# EAGLE design untitled (EAGLE 9.1.3)

## Sheet 1 of 2
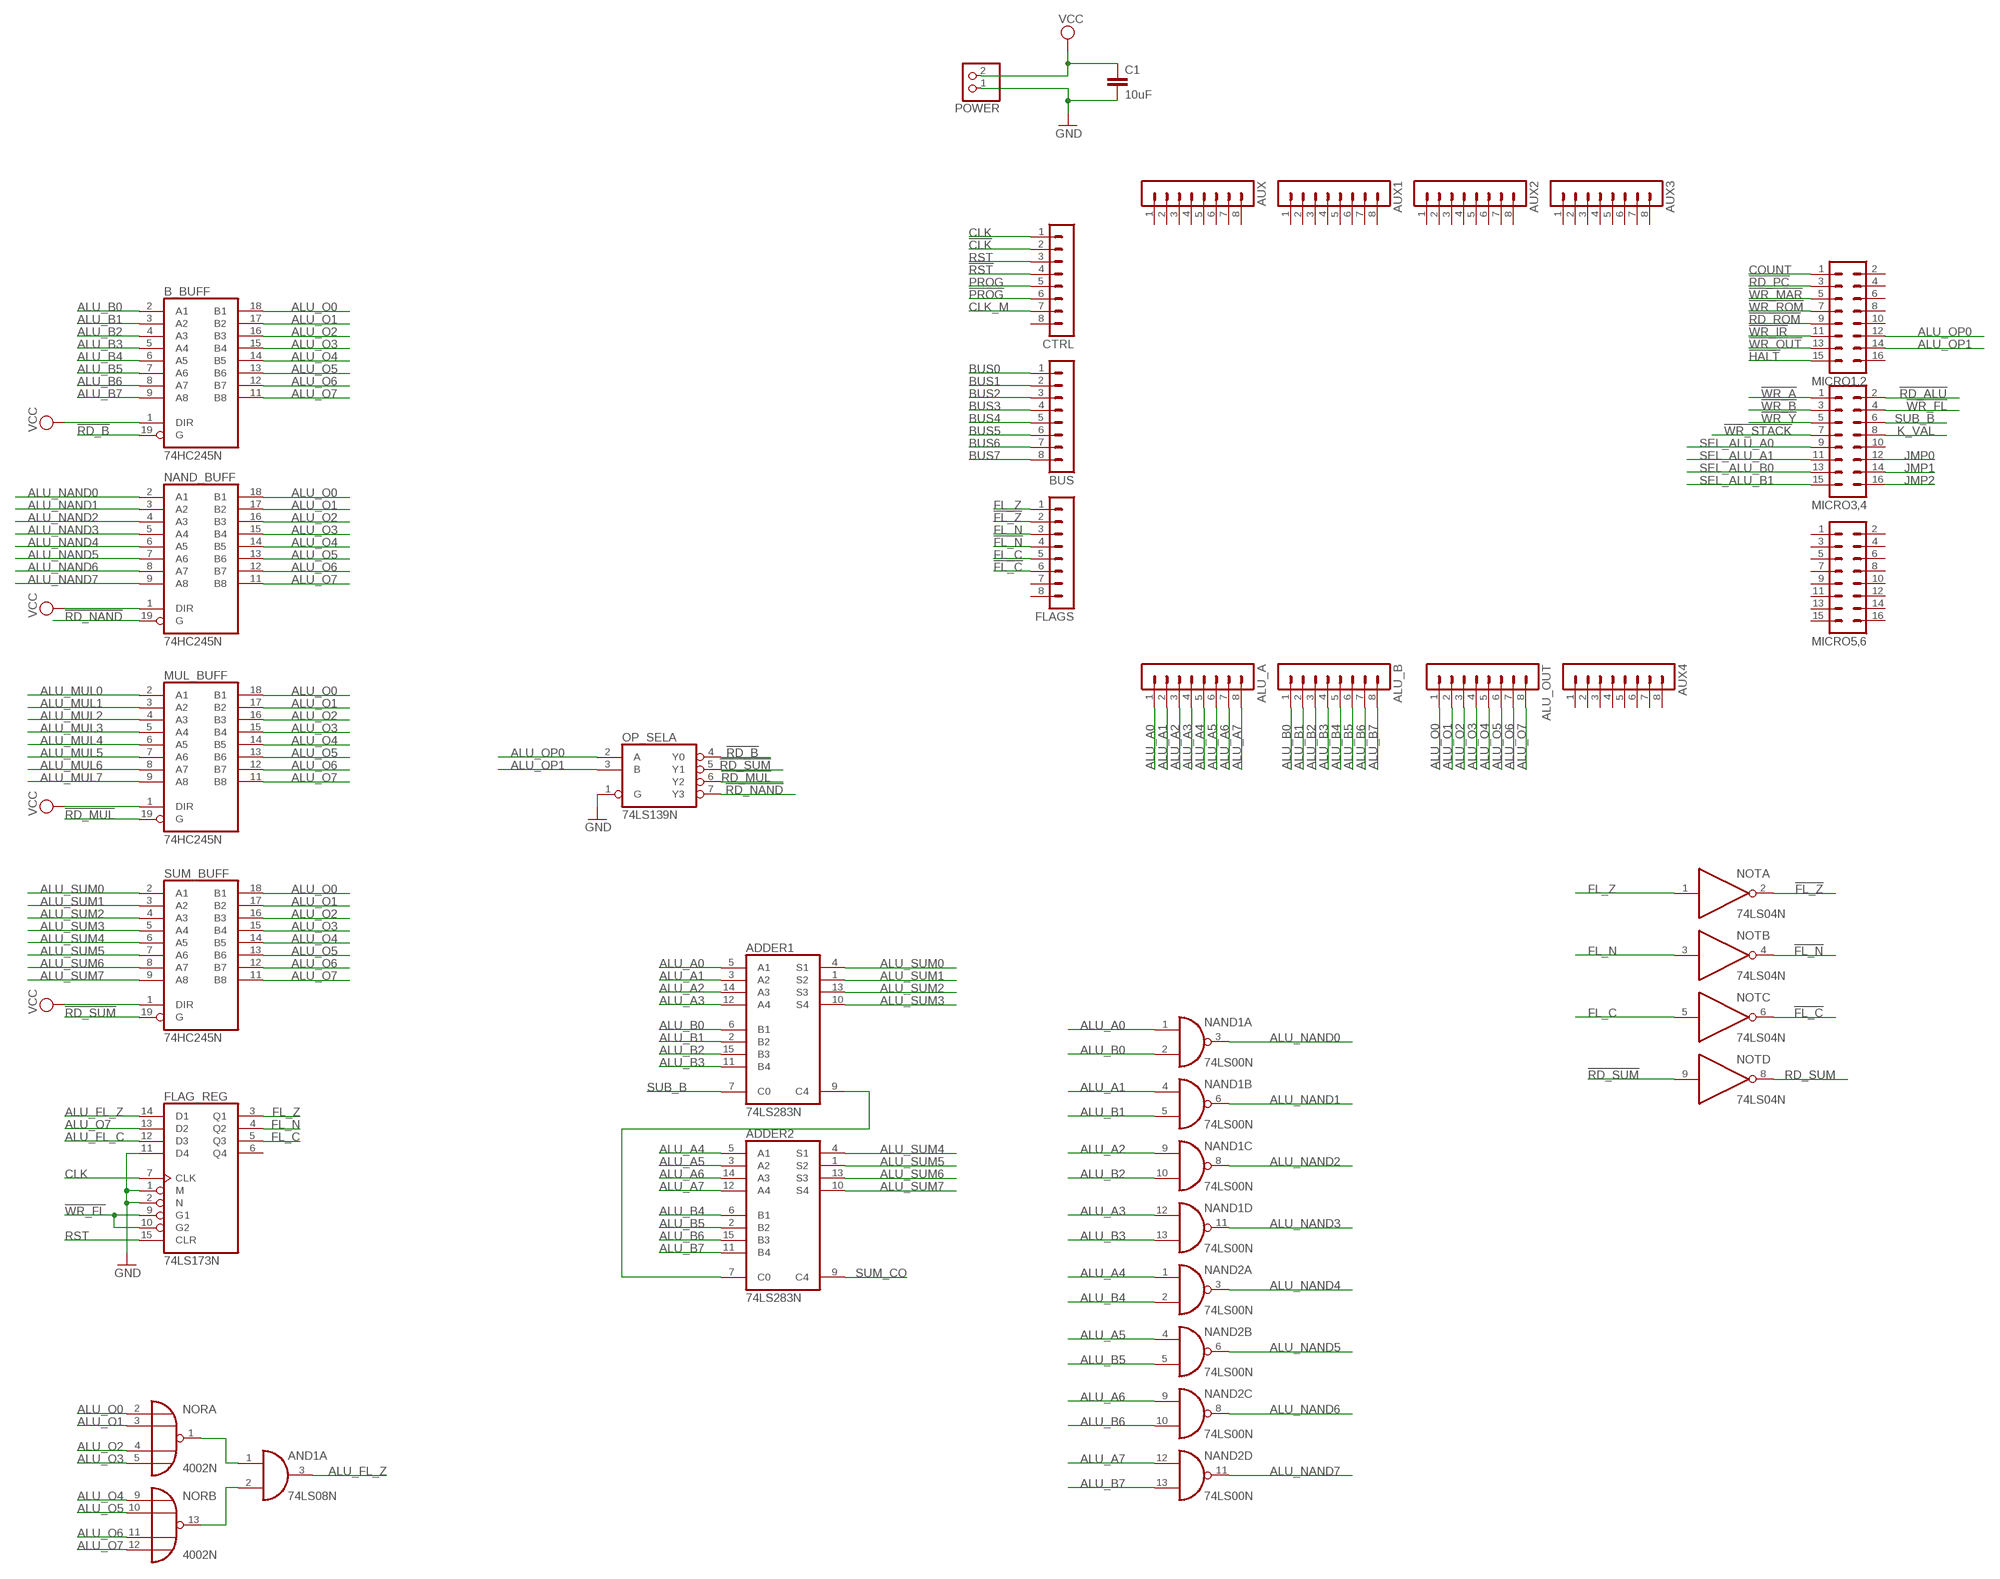
[diagram p0: schematic, sheet 1, part 1 of 2]
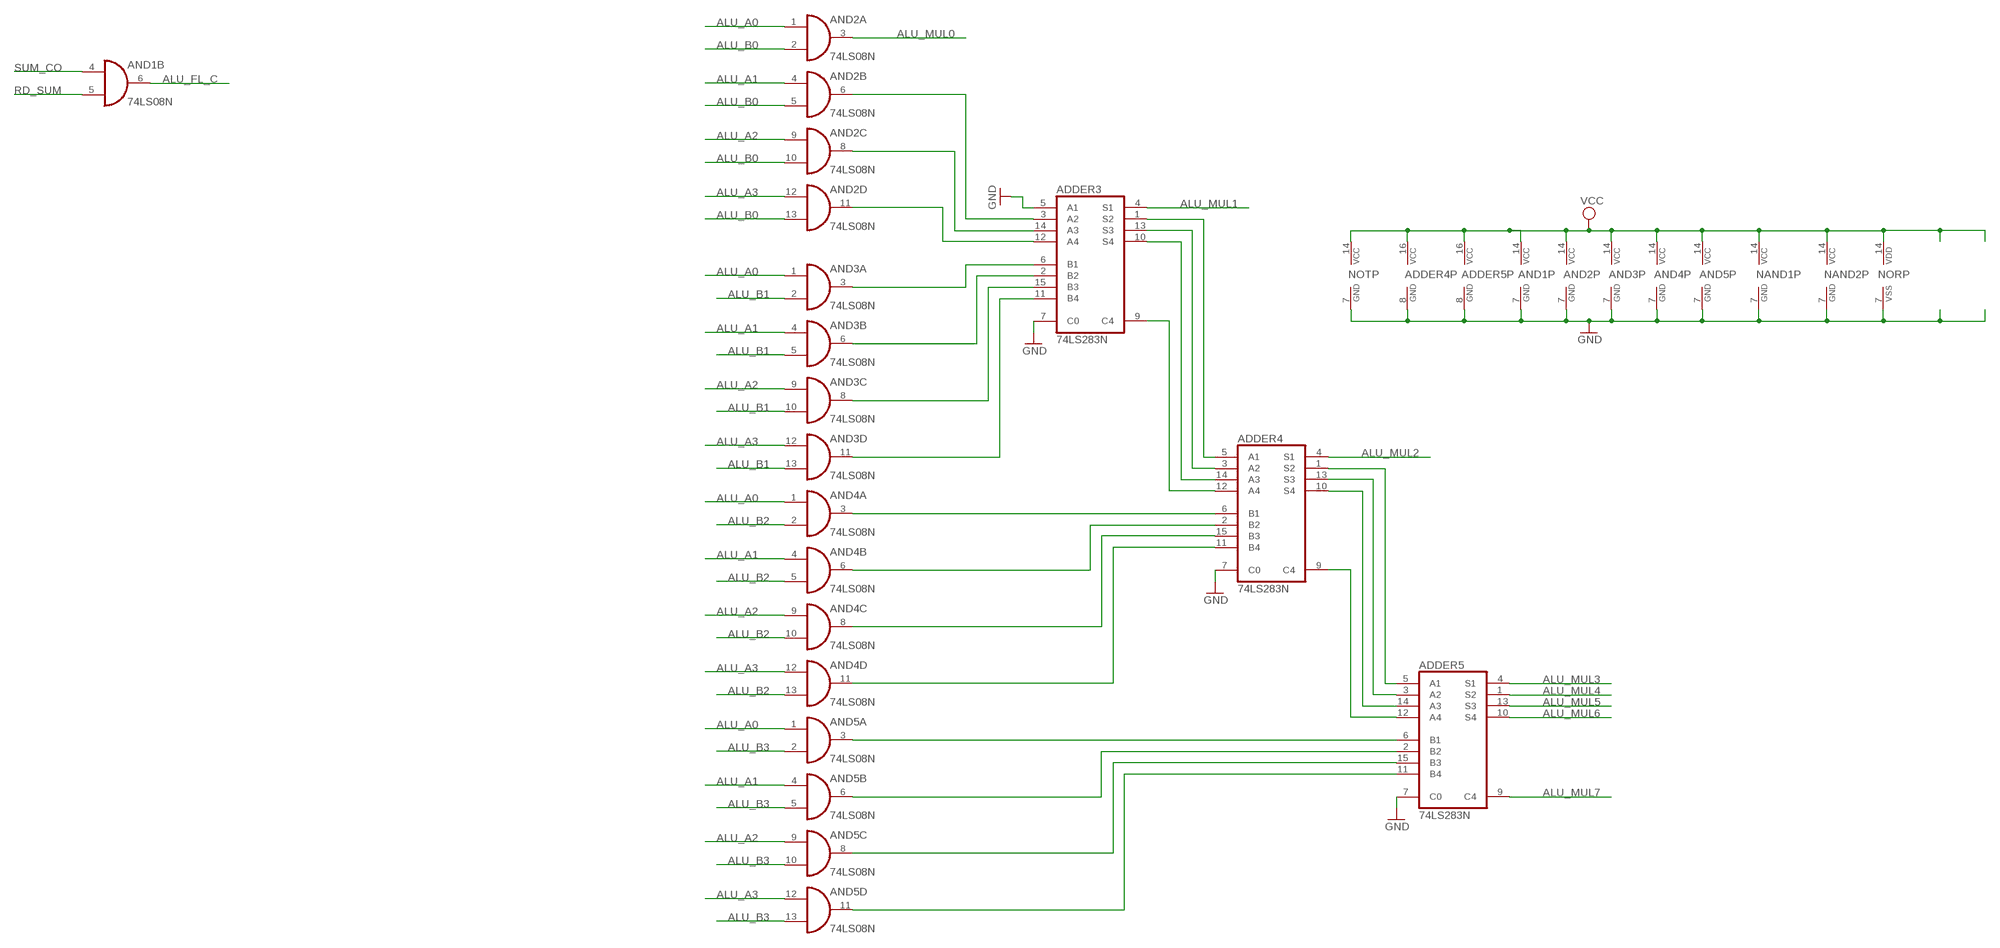
[diagram p1: schematic, sheet 1, part 2 of 2]

### Parts
ADDER1  74LS283N  [DIL16]
ADDER2  74LS283N  [DIL16]
ADDER3  74LS283N  [DIL16]
ADDER4  74LS283N  [DIL16]
ADDER5  74LS283N  [DIL16]
ALU_A  MA08-1  [MA08-1]
ALU_B  MA08-1  [MA08-1]
ALU_OUT  MA08-1  [MA08-1]
AND1  74LS08N  [DIL14]
AND2  74LS08N  [DIL14]
AND3  74LS08N  [DIL14]
AND4  74LS08N  [DIL14]
AND5  74LS08N  [DIL14]
AUX  MA08-1  [MA08-1]
AUX1  MA08-1  [MA08-1]
AUX2  MA08-1  [MA08-1]
AUX3  MA08-1  [MA08-1]
AUX4  MA08-1  [MA08-1]
B_BUFF  74HC245N  [DIL20]
BUS  MA08-1  [MA08-1]
C1  10uF  C-EU025-050X050  [C025-050X050]
CTRL  MA08-1  [MA08-1]
FLAG_REG  74LS173N  [DIL16]
FLAGS  MA08-1  [MA08-1]
MICRO1,2  MA08-2  [MA08-2]
MICRO3,4  MA08-2  [MA08-2]
MICRO5,6  MA08-2  [MA08-2]
MUL_BUFF  74HC245N  [DIL20]
NAND1  74LS00N  [DIL14]
NAND2  74LS00N  [DIL14]
NAND_BUFF  74HC245N  [DIL20]
NOR  4002N  [DIL14]
NOT  74LS04N  [DIL14]
OP_SEL  74LS139N  [DIL16]
POWER  PINHD-1X2  [1X02]
SUM_BUFF  74HC245N  [DIL20]

### Nets
!CLK: CTRL.2
!FL_C: FLAGS.6 NOT.6(C:O)
!FL_N: FLAGS.4 NOT.4(B:O)
!FL_Z: FLAGS.2 NOT.2(A:O)
!HALT: MICRO1,2.15
!PROG: CTRL.6
!RD_ALU: MICRO3,4.2
!RD_B: B_BUFF.19(G) OP_SEL.4(A:Y0)
!RD_MUL: MUL_BUFF.19(G) OP_SEL.6(A:Y2)
!RD_NAND: NAND_BUFF.19(G) OP_SEL.7(A:Y3)
!RD_PC: MICRO1,2.3
!RD_ROM: MICRO1,2.9
!RD_SUM: NOT.9(D:I) OP_SEL.5(A:Y1) SUM_BUFF.19(G)
!RST: CTRL.4
!WR_A: MICRO3,4.1
!WR_B: MICRO3,4.3
!WR_FL: FLAG_REG.9(G1) FLAG_REG.10(G2) MICRO3,4.4
!WR_IR: MICRO1,2.11
!WR_MAR: MICRO1,2.5
!WR_OUT: MICRO1,2.13
!WR_ROM: MICRO1,2.7
!WR_STACK: MICRO3,4.7
!WR_Y: MICRO3,4.5
ALU_A0: ADDER1.5(A1) ALU_A.1 AND2.1(A:I0) AND3.1(A:I0) AND4.1(A:I0) AND5.1(A:I0) NAND1.1(A:I0)
ALU_A1: ADDER1.3(A2) ALU_A.2 AND2.4(B:I0) AND3.4(B:I0) AND4.4(B:I0) AND5.4(B:I0) NAND1.4(B:I0)
ALU_A2: ADDER1.14(A3) ALU_A.3 AND2.9(C:I0) AND3.9(C:I0) AND4.9(C:I0) AND5.9(C:I0) NAND1.9(C:I0)
ALU_A3: ADDER1.12(A4) ALU_A.4 AND2.12(D:I0) AND3.12(D:I0) AND4.12(D:I0) AND5.12(D:I0) NAND1.12(D:I0)
ALU_A4: ADDER2.5(A1) ALU_A.5 NAND2.1(A:I0)
ALU_A5: ADDER2.3(A2) ALU_A.6 NAND2.4(B:I0)
ALU_A6: ADDER2.14(A3) ALU_A.7 NAND2.9(C:I0)
ALU_A7: ADDER2.12(A4) ALU_A.8 NAND2.12(D:I0)
ALU_B0: ADDER1.6(B1) ALU_B.1 AND2.2(A:I1) AND2.5(B:I1) AND2.10(C:I1) AND2.13(D:I1) B_BUFF.2(A1) NAND1.2(A:I1)
ALU_B1: ADDER1.2(B2) ALU_B.2 AND3.2(A:I1) AND3.5(B:I1) AND3.10(C:I1) AND3.13(D:I1) B_BUFF.3(A2) NAND1.5(B:I1)
ALU_B2: ADDER1.15(B3) ALU_B.3 AND4.2(A:I1) AND4.5(B:I1) AND4.10(C:I1) AND4.13(D:I1) B_BUFF.4(A3) NAND1.10(C:I1)
ALU_B3: ADDER1.11(B4) ALU_B.4 AND5.2(A:I1) AND5.5(B:I1) AND5.10(C:I1) AND5.13(D:I1) B_BUFF.5(A4) NAND1.13(D:I1)
ALU_B4: ADDER2.6(B1) ALU_B.5 B_BUFF.6(A5) NAND2.2(A:I1)
ALU_B5: ADDER2.2(B2) ALU_B.6 B_BUFF.7(A6) NAND2.5(B:I1)
ALU_B6: ADDER2.15(B3) ALU_B.7 B_BUFF.8(A7) NAND2.10(C:I1)
ALU_B7: ADDER2.11(B4) ALU_B.8 B_BUFF.9(A8) NAND2.13(D:I1)
ALU_FL_C: AND1.6(B:O) FLAG_REG.12(D3)
ALU_FL_Z: AND1.3(A:O) FLAG_REG.14(D1)
ALU_MUL0: AND2.3(A:O) MUL_BUFF.2(A1)
ALU_MUL1: ADDER3.4(S1) MUL_BUFF.3(A2)
ALU_MUL2: ADDER4.4(S1) MUL_BUFF.4(A3)
ALU_MUL3: ADDER5.4(S1) MUL_BUFF.5(A4)
ALU_MUL4: ADDER5.1(S2) MUL_BUFF.6(A5)
ALU_MUL5: ADDER5.13(S3) MUL_BUFF.7(A6)
ALU_MUL6: ADDER5.10(S4) MUL_BUFF.8(A7)
ALU_MUL7: ADDER5.9(C4) MUL_BUFF.9(A8)
ALU_NAND0: NAND1.3(A:O) NAND_BUFF.2(A1)
ALU_NAND1: NAND1.6(B:O) NAND_BUFF.3(A2)
ALU_NAND2: NAND1.8(C:O) NAND_BUFF.4(A3)
ALU_NAND3: NAND1.11(D:O) NAND_BUFF.5(A4)
ALU_NAND4: NAND2.3(A:O) NAND_BUFF.6(A5)
ALU_NAND5: NAND2.6(B:O) NAND_BUFF.7(A6)
ALU_NAND6: NAND2.8(C:O) NAND_BUFF.8(A7)
ALU_NAND7: NAND2.11(D:O) NAND_BUFF.9(A8)
ALU_O0: ALU_OUT.1 B_BUFF.18(B1) MUL_BUFF.18(B1) NAND_BUFF.18(B1) NOR.2(A:I0) SUM_BUFF.18(B1)
ALU_O1: ALU_OUT.2 B_BUFF.17(B2) MUL_BUFF.17(B2) NAND_BUFF.17(B2) NOR.3(A:I1) SUM_BUFF.17(B2)
ALU_O2: ALU_OUT.3 B_BUFF.16(B3) MUL_BUFF.16(B3) NAND_BUFF.16(B3) NOR.4(A:I2) SUM_BUFF.16(B3)
ALU_O3: ALU_OUT.4 B_BUFF.15(B4) MUL_BUFF.15(B4) NAND_BUFF.15(B4) NOR.5(A:I3) SUM_BUFF.15(B4)
ALU_O4: ALU_OUT.5 B_BUFF.14(B5) MUL_BUFF.14(B5) NAND_BUFF.14(B5) NOR.9(B:I0) SUM_BUFF.14(B5)
ALU_O5: ALU_OUT.6 B_BUFF.13(B6) MUL_BUFF.13(B6) NAND_BUFF.13(B6) NOR.10(B:I1) SUM_BUFF.13(B6)
ALU_O6: ALU_OUT.7 B_BUFF.12(B7) MUL_BUFF.12(B7) NAND_BUFF.12(B7) NOR.11(B:I2) SUM_BUFF.12(B7)
ALU_O7: ALU_OUT.8 B_BUFF.11(B8) FLAG_REG.13(D2) MUL_BUFF.11(B8) NAND_BUFF.11(B8) NOR.12(B:I3) SUM_BUFF.11(B8)
ALU_OP0: MICRO1,2.12 OP_SEL.2(A:A)
ALU_OP1: MICRO1,2.14 OP_SEL.3(A:B)
ALU_SUM0: ADDER1.4(S1) SUM_BUFF.2(A1)
ALU_SUM1: ADDER1.1(S2) SUM_BUFF.3(A2)
ALU_SUM2: ADDER1.13(S3) SUM_BUFF.4(A3)
ALU_SUM3: ADDER1.10(S4) SUM_BUFF.5(A4)
ALU_SUM4: ADDER2.4(S1) SUM_BUFF.6(A5)
ALU_SUM5: ADDER2.1(S2) SUM_BUFF.7(A6)
ALU_SUM6: ADDER2.13(S3) SUM_BUFF.8(A7)
ALU_SUM7: ADDER2.10(S4) SUM_BUFF.9(A8)
BUS0: BUS.1
BUS1: BUS.2
BUS2: BUS.3
BUS3: BUS.4
BUS4: BUS.5
BUS5: BUS.6
BUS6: BUS.7
BUS7: BUS.8
CLK: CTRL.1 FLAG_REG.7(CLK)
CLK_M: CTRL.7
COUNT: MICRO1,2.1
FL_C: FLAG_REG.5(Q3) FLAGS.5 NOT.5(C:I)
FL_N: FLAG_REG.4(Q2) FLAGS.3 NOT.3(B:I)
FL_Z: FLAG_REG.3(Q1) FLAGS.1 NOT.1(A:I)
GND: ADDER3.5(A1) ADDER3.7(C0) ADDER4.7(C0) ADDER4.8(GND) ADDER5.7(C0) ADDER5.8(GND) AND1.7(P:GND) AND2.7(P:GND) AND3.7(P:GND) AND4.7(P:GND) AND5.7(P:GND) C1.2 FLAG_REG.1(M) FLAG_REG.2(N) FLAG_REG.11(D4) NAND1.7(P:GND) NAND2.7(P:GND) NOR.7(P:VSS) NOT.7(P:GND) OP_SEL.1(A:G) POWER.1
JMP0: MICRO3,4.12
JMP1: MICRO3,4.14
JMP2: MICRO3,4.16
K_VAL: MICRO3,4.8
N$1: ADDER3.11(B4) AND3.11(D:O)
N$2: ADDER3.15(B3) AND3.8(C:O)
N$3: ADDER3.2(B2) AND3.6(B:O)
N$4: ADDER1.9(C4) ADDER2.7(C0)
N$5: ADDER3.6(B1) AND3.3(A:O)
N$8: ADDER3.12(A4) AND2.11(D:O)
N$9: ADDER3.14(A3) AND2.8(C:O)
N$10: ADDER3.3(A2) AND2.6(B:O)
N$11: ADDER4.11(B4) AND4.11(D:O)
N$12: ADDER4.15(B3) AND4.8(C:O)
N$13: ADDER4.2(B2) AND4.6(B:O)
N$14: ADDER4.6(B1) AND4.3(A:O)
N$15: ADDER3.1(S2) ADDER4.5(A1)
N$16: ADDER3.13(S3) ADDER4.3(A2)
N$17: ADDER3.10(S4) ADDER4.14(A3)
N$18: ADDER3.9(C4) ADDER4.12(A4)
N$19: ADDER5.6(B1) AND5.3(A:O)
N$20: ADDER5.2(B2) AND5.6(B:O)
N$21: ADDER5.15(B3) AND5.8(C:O)
N$22: ADDER5.11(B4) AND5.11(D:O)
N$23: ADDER4.1(S2) ADDER5.5(A1)
N$24: ADDER4.13(S3) ADDER5.3(A2)
N$25: ADDER4.10(S4) ADDER5.14(A3)
N$26: AND1.1(A:I0) NOR.1(A:O)
N$27: AND1.2(A:I1) NOR.13(B:O)
N$28: ADDER4.9(C4) ADDER5.12(A4)
PROG: CTRL.5
RD_SUM: AND1.5(B:I1) NOT.8(D:O)
RST: CTRL.3 FLAG_REG.15(CLR)
SEL_ALU_A0: MICRO3,4.9
SEL_ALU_A1: MICRO3,4.11
SEL_ALU_B0: MICRO3,4.13
SEL_ALU_B1: MICRO3,4.15
SUB_B: ADDER1.7(C0) MICRO3,4.6
SUM_CO: ADDER2.9(C4) AND1.4(B:I0)
VCC: ADDER4.16(VCC) ADDER5.16(VCC) AND1.14(P:VCC) AND2.14(P:VCC) AND3.14(P:VCC) AND4.14(P:VCC) AND5.14(P:VCC) B_BUFF.1(DIR) C1.1 MUL_BUFF.1(DIR) NAND1.14(P:VCC) NAND2.14(P:VCC) NAND_BUFF.1(DIR) NOR.14(P:VDD) NOT.14(P:VCC) POWER.2 SUM_BUFF.1(DIR)
Unconnected: AND1.8(C:O) AND1.9(C:I0) AND1.10(C:I1) AND1.11(D:O) AND1.12(D:I0) AND1.13(D:I1) AUX1.1 AUX1.2 AUX1.3 AUX1.4 AUX1.5 AUX1.6 AUX1.7 AUX1.8 AUX2.1 AUX2.2 AUX2.3 AUX2.4 AUX2.5 AUX2.6 AUX2.7 AUX2.8 AUX3.1 AUX3.2 AUX3.3 AUX3.4 AUX3.5 AUX3.6 AUX3.7 AUX3.8 AUX4.1 AUX4.2 AUX4.3 AUX4.4 AUX4.5 AUX4.6 AUX4.7 AUX4.8 AUX.1 AUX.2 AUX.3 AUX.4 AUX.5 AUX.6 AUX.7 AUX.8 CTRL.8 FLAG_REG.6(Q4) FLAGS.7 FLAGS.8 MICRO1,2.2 MICRO1,2.4 MICRO1,2.6 MICRO1,2.8 MICRO1,2.10 MICRO1,2.16 MICRO3,4.10 MICRO5,6.1 MICRO5,6.2 MICRO5,6.3 MICRO5,6.4 MICRO5,6.5 MICRO5,6.6 MICRO5,6.7 MICRO5,6.8 MICRO5,6.9 MICRO5,6.10 MICRO5,6.11 MICRO5,6.12 MICRO5,6.13 MICRO5,6.14 MICRO5,6.15 MICRO5,6.16 NOT.10(E:O) NOT.11(E:I) NOT.12(F:O) NOT.13(F:I) OP_SEL.9(B:Y3) OP_SEL.10(B:Y2) OP_SEL.11(B:Y1) OP_SEL.12(B:Y0) OP_SEL.13(B:B) OP_SEL.14(B:A) OP_SEL.15(B:G)

## Sheet 2 of 2

## Power pins joined to a net without a drawn wire
GND: ADDER1.8(GND) ADDER2.8(GND) ADDER3.8(GND) B_BUFF.10(GND) FLAG_REG.8(GND) MUL_BUFF.10(GND) NAND_BUFF.10(GND) OP_SEL.8(P:GND) SUM_BUFF.10(GND)
VCC: ADDER1.16(VCC) ADDER2.16(VCC) ADDER3.16(VCC) B_BUFF.20(VCC) FLAG_REG.16(VCC) MUL_BUFF.20(VCC) NAND_BUFF.20(VCC) OP_SEL.16(P:VCC) SUM_BUFF.20(VCC)

## Library data of the parts
ADDER1-ADDER5 = 74xx-eu:74*283: 4-bit binary FULL ADDER, fast carry
ALU_A ALU_B ALU_OUT AUX AUX1-AUX4 BUS CTRL FLAGS = con-lstb:MA08-1: PIN HEADER; OC_FARNELL: unknown; OC_NEWARK: unknown
AND1-AND5 = 74xx-eu:74*08: Quad 2-input AND gate
B_BUFF MUL_BUFF NAND_BUFF SUM_BUFF = 74xx-eu:74*245: Octal BUS TRANSCEIVER, 3-state
C1 = rcl:C-EU: CAPACITOR, European symbol; SPICEPREFIX: C
FLAG_REG = 74xx-eu:74*173: 4-bit D type REGISTER, 3-state
MICRO1,2 MICRO3,4 MICRO5,6 = con-lstb:MA08-2: PIN HEADER; OC_FARNELL: unknown; OC_NEWARK: unknown
NAND1 NAND2 = 74xx-eu:74*00: Quad 2-input NAND gate
NOR = 40xx:4002: 4-input NOR
NOT = 74xx-eu:74*04: Hex INVERTER
OP_SEL = 74xx-eu:74*139: Dual 2-line to 4-line DECODER/DEMULTIPLEXER
POWER = pinhead:PINHD-1X2: PIN HEADER

## Board
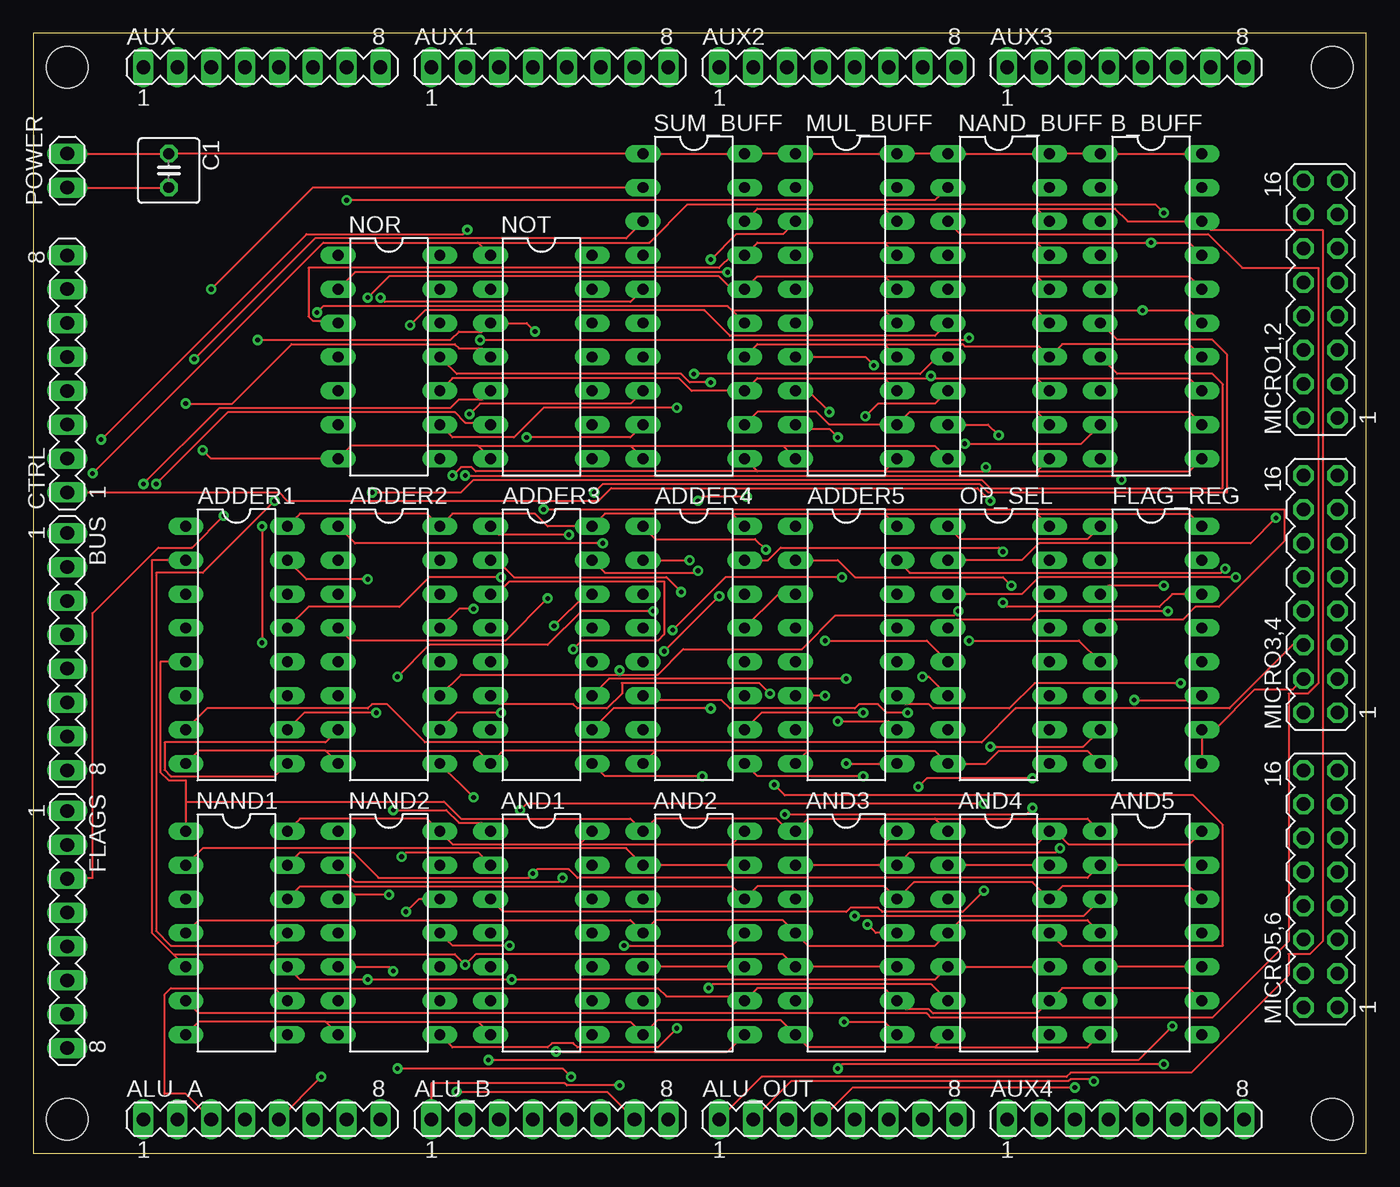
[diagram p2: board, top side]
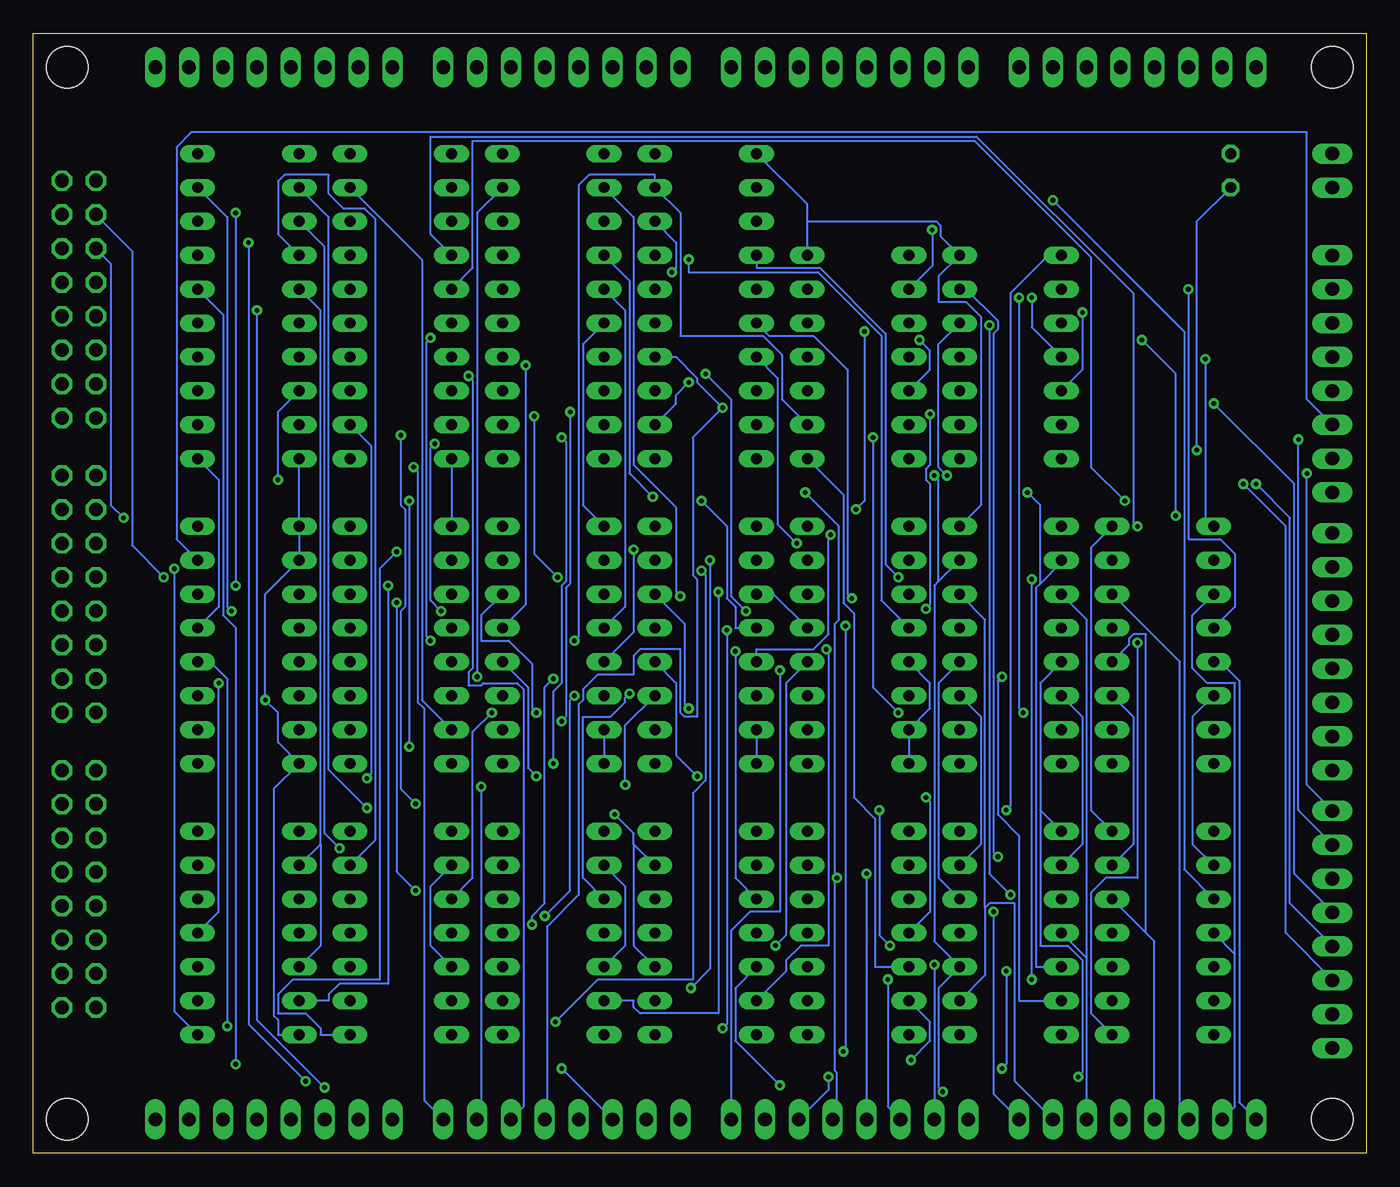
[diagram p3: board, bottom side, seen from below]

Size 99.95 x 83.95 mm. Coordinates in mm from the lower left corner, seen from the top.
Outline: 0,0 99.95,0 99.95,83.95 0,83.95 0,0
Copper layers (1*16): Top 0.035mm / dielectric 1.5mm / Bottom 0.035mm
Design rules "default": minimum track width 6mil, minimum drill 0.35mm, track to track 6mil, track to pad 6mil, pad to pad 6mil, via to via 6mil, smd to smd 6mil, copper to edge 40mil, drill to drill 6mil, minimum pad ring 10mil, minimum via ring 8mil, stop-mask expansion 4mil, vias tented up to drill 0mil, thermal gap 10mil
Holes 3.1 mm at 2.54,81.41 97.41,81.41 2.54,2.54 97.41,2.54

### Footprints (pad centres in the part's own frame; a part is rotated, then mirrored left to right if it is on the bottom)
DIL16 = drill 0.813 long: 1 -8.89,-3.81; 2 -6.35,-3.81; 3 -3.81,-3.81; 4 -1.27,-3.81; 5 1.27,-3.81; 6 3.81,-3.81; 7 6.35,-3.81; 8 8.89,-3.81; 9 8.89,3.81; 10 6.35,3.81; 11 3.81,3.81; 12 1.27,3.81; 13 -1.27,3.81; 14 -3.81,3.81; 15 -6.35,3.81; 16 -8.89,3.81
MA08-1 = drill 1.016 long: 1 -8.89,0; 2 -6.35,0; 3 -3.81,0; 4 -1.27,0; 5 1.27,0; 6 3.81,0; 7 6.35,0; 8 8.89,0
DIL14 = drill 0.813 long: 1 -7.62,-3.81; 2 -5.08,-3.81; 3 -2.54,-3.81; 4 0,-3.81; 5 2.54,-3.81; 6 5.08,-3.81; 7 7.62,-3.81; 8 7.62,3.81; 9 5.08,3.81; 10 2.54,3.81; 11 0,3.81; 12 -2.54,3.81; 13 -5.08,3.81; 14 -7.62,3.81
DIL20 = drill 0.813 long: 1 -11.43,-3.81; 2 -8.89,-3.81; 3 -6.35,-3.81; 4 -3.81,-3.81; 5 -1.27,-3.81; 6 1.27,-3.81; 7 3.81,-3.81; 8 6.35,-3.81; 9 8.89,-3.81; 10 11.43,-3.81; 11 11.43,3.81; 12 8.89,3.81; 13 6.35,3.81; 14 3.81,3.81; 15 1.27,3.81; 16 -1.27,3.81; 17 -3.81,3.81; 18 -6.35,3.81; 19 -8.89,3.81; 20 -11.43,3.81
C025-050X050 = drill 0.813 octagon: 1 -1.27,0; 2 1.27,0
MA08-2 = drill 1.016 octagon: 1 -8.89,-1.27; 2 -8.89,1.27; 3 -6.35,-1.27; 4 -6.35,1.27; 5 -3.81,-1.27; 6 -3.81,1.27; 7 -1.27,-1.27; 8 -1.27,1.27; 9 1.27,-1.27; 10 1.27,1.27; 11 3.81,-1.27; 12 3.81,1.27; 13 6.35,-1.27; 14 6.35,1.27; 15 8.89,-1.27; 16 8.89,1.27
1X02 = drill 1.016 long: 1 -1.27,0; 2 1.27,0

### Placement (x,y rotation side)
ADDER1  15.24,38.1 270 top
ADDER2  26.67,38.1 270 top
ADDER3  38.1,38.1 270 top
ADDER4  49.53,38.1 270 top
ADDER5  60.96,38.1 270 top
ALU_A  17.14,2.54 0 top
ALU_B  38.73,2.54 0 top
ALU_OUT  60.33,2.54 0 top
AND1  38.1,16.51 270 top
AND2  49.53,16.51 270 top
AND3  60.96,16.51 270 top
AND4  72.39,16.51 270 top
AND5  83.82,16.51 270 top
AUX  17.14,81.41 0 top
AUX1  38.73,81.41 0 top
AUX2  60.33,81.41 0 top
AUX3  81.92,81.41 0 top
AUX4  81.92,2.54 0 top
B_BUFF  83.82,63.5 270 top
BUS  2.54,37.59 270 top
C1  10.16,73.66 270 top
CTRL  2.54,58.42 90 top
FLAG_REG  83.82,38.1 270 top
FLAGS  2.54,16.76 270 top
MICRO1,2  96.52,64.01 90 top
MICRO3,4  96.52,41.91 90 top
MICRO5,6  96.52,19.81 90 top
MUL_BUFF  60.96,63.5 270 top
NAND1  15.24,16.51 270 top
NAND2  26.67,16.51 270 top
NAND_BUFF  72.39,63.5 270 top
NOR  26.67,59.69 270 top
NOT  38.1,59.69 270 top
OP_SEL  72.39,38.1 270 top
POWER  2.54,73.66 90 top
SUM_BUFF  49.53,63.5 270 top

### Tracks (layer width: path | path; a pad name or v marks a point on that pad's centre or on a via)
!FL_C  (via drill 0.35)
  Top 0.152: NOT.6 34.13,54.77 32.38,54.77 31.59,55.56 14.61,55.56 v9.21,50.16
  Bottom 0.152: v9.21,50.16 6.03,46.99 6.03,16.51 2.54,13.02 FLAGS.6
!FL_N  (via drill 0.35)
  Top 0.152: NOT.4 33.66,60.33 31.91,60.33 31.59,60.64 19.37,60.64 14.92,56.2 v11.43,56.2
  Bottom 0.152: v11.43,56.2 5.4,50.16 5.4,20.95 2.54,18.1 FLAGS.4
!FL_Z  (via drill 0.35)
  Top 0.152: v32.54,69.22 32.23,68.9 20.48,68.9 v5.08,53.5
  Bottom 0.152: NOT.2 32.54,66.52 v32.54,69.22 | v5.08,53.5 5.08,25.72 2.54,23.18 FLAGS.2
!RD_B  (via drill 0.35)
  Top 0.152: OP_SEL.4 69.22,40.01 74.77,40.01 75.41,40.64 v85.09,40.64
  Bottom 0.152: v85.09,40.64 85.41,40.96 85.41,70.17 B_BUFF.19
!RD_MUL  (via drill 0.35)
  Top 0.152: OP_SEL.6 67.15,35.72 v66.67,35.72
  Bottom 0.152: v66.67,35.72 66.67,70.48 MUL_BUFF.19
!RD_NAND
  Bottom 0.152: OP_SEL.7 70.8,33.97 70.8,66.99 NAND_BUFF.19
!RD_SUM  (via drill 0.35)
  Top 0.152: OP_SEL.5 66.99,38.42 v59.37,38.42
  Bottom 0.152: NOT.9 43.81,56.52 43.81,59.85 45.24,61.28 51.44,61.28 51.44,70.48 SUM_BUFF.19 53.34,73.34 58.26,73.34 59.05,72.55 59.05,38.73 v59.37,38.42
!WR_FL
  Top 0.152: FLAG_REG.9 FLAG_REG.10 88.58,31.75 91.6,34.77 94.46,34.77 MICRO3,4.4
ALU_A0
  Top 0.152: 67.63,25.08 AND4.1 | 67.63,25.08 58.1,25.08 AND3.1 56.67,24.13 55.72,25.08 46.67,25.08 AND2.1 44.77,25.08 32.07,25.08 30.8,26.35 11.43,26.35 | AND5.1 79.06,25.08 67.63,25.08 | 11.43,26.35 11.43,27.94 10.16,27.94 9.53,28.57 9.53,36.83 ADDER1.5 | 11.43,26.35 NAND1.1
  Bottom 0.152: ALU_A.1 9.53,3.81 9.53,35.4 10.95,36.83 ADDER1.5
ALU_A1
  Top 0.152: AND5.4 79.06,17.46 69.53,17.46 AND4.4 67.63,15.56 58.1,15.56 AND3.4 56.2,17.46 46.67,17.46 AND2.4 44.77,17.46 12.38,17.46 NAND1.4
  Bottom 0.152: 9.84,14.92 NAND1.4 | 9.84,14.92 9.84,3.49 ALU_A.2 | ADDER1.3 13.02,40.32 13.02,36.35 11.91,35.24 9.84,35.24 9.84,14.92
ALU_A2
  Top 0.152: AND5.9 86.68,12.38 77.15,12.38 AND4.9 75.25,10.48 67.47,10.48 67.15,10.79 65.41,10.79 AND3.9 63.82,12.38 54.29,12.38 AND2.9 53.02,11.75 47.47,11.75 46.83,12.38 18.1,12.38 | 18.1,12.38 NAND1.9 | 18.1,12.38 10.32,12.38 9.84,11.91 9.84,4.45 11.43,4.45 ALU_A.3
  Bottom 0.152: ADDER1.14 13.97,36.83 13.97,3.17 ALU_A.3
ALU_A3
  Top 0.152: AND5.12 86.68,20 77.15,20 AND4.12 74.93,20.32 66.04,20.32 AND3.12 63.82,20 54.29,20 AND2.12 52.39,20 20,20 NAND1.12
  Bottom 0.152: 16.51,16.51 15.88,15.88 ALU_A.4 | 16.51,16.51 NAND1.12 | ADDER1.12 17.78,38.1 17.78,38.58 17.46,38.89 16.51,38.89 16.51,16.51
ALU_A4  (via drill 0.35)
  Top 0.152: v21.59,5.71 ALU_A.5
  Bottom 0.152: 24.45,25.72 NAND2.1 | 24.45,25.72 24.45,35.24 ADDER2.5 | v21.59,5.71 21.27,6.03 21.27,14.45 22.38,15.56 24.45,15.56 24.45,25.72
ALU_A5
  Bottom 0.152: 20.95,14.61 NAND2.4 | ALU_A.6 20.95,14.61 | ADDER2.3 20.95,40.01 20.95,14.61
ALU_A6
  Bottom 0.152: NAND2.9 28.57,13.34 28.57,18.41 | 28.57,18.41 28.26,18.73 26.35,18.73 26.35,5.4 ALU_A.7 | ADDER2.14 28.57,40.01 28.57,18.41
ALU_A7  (via drill 0.35)
  Top 0.152: v27.94,18.1 28.89,19.05 NAND2.12
  Bottom 0.152: NAND2.12 32.07,20.64 32.07,35.24 ADDER2.12 | ALU_A.8 27.94,4.45 v27.94,18.1
ALU_B0  (via drill 0.35)
  Top 0.152: AND2.10 AND2.5 | ALU_B.1 29.84,5.24 39.85,5.24 40.01,5.08 v43.97,5.08 | AND2.13 AND2.2 44.45,22.86 12.7,22.86 NAND1.2 | v74.93,25.88 74.45,25.4 v56.36,25.4
  Bottom 0.152: v43.97,5.08 47.31,8.41 47.31,12.38 AND2.5 | NAND1.2 13.02,23.18 13.02,32.7 ADDER1.6 | B_BUFF.2 77.79,70.17 77.79,28.73 v74.93,25.88 | v56.36,25.4 54.93,23.97 54.93,23.18 | AND2.13 54.93,23.18 | AND2.10 54.93,15.56 54.93,23.18
ALU_B1  (via drill 0.35)
  Top 0.152: 10.48,14.92 8.89,16.51 8.89,44.45 ADDER1.2 | 10.48,14.92 NAND1.5 | 10.48,14.92 31.59,14.92 v32.38,14.13 33.18,14.92 56.2,14.92 AND3.5 AND3.10 | AND3.2 AND3.13 65.72,22.54 76.68,22.54 v76.99,22.86
  Bottom 0.152: v32.38,14.13 ALU_B.2 | B_BUFF.3 78.11,67.94 78.11,23.97 v76.99,22.86 | AND3.5 55.56,15.56 55.56,20 AND3.2
ALU_B2  (via drill 0.35)
  Top 0.152: AND4.13 AND4.2 | NAND1.10 20,13.02 v25.08,13.02 v35.88,13.02 67.63,13.02 AND4.5 AND4.10 | ADDER1.15 20.48,43.02 v25.08,43.02
  Bottom 0.152: B_BUFF.4 81.6,68.9 81.6,72.87 81.12,73.34 77.79,73.34 77.79,71.91 76.68,70.8 75.09,70.8 74.3,70.01 74.3,23.5 AND4.13 | v25.08,13.02 v25.08,43.02 | ALU_B.3 35.88,3.49 v35.88,13.02 | AND4.2 70.17,20 70.17,15.56 AND4.5
ALU_B3  (via drill 0.35)
  Top 0.152: NAND1.13 20,22.54 23.97,22.54 25.88,20.64 37.15,20.64 v37.47,20.95 37.78,21.27 40.16,21.27 40.8,20.64 79.06,20.64 AND5.2 AND5.13 | AND5.10 AND5.5
  Bottom 0.152: NAND1.13 17.46,23.18 17.46,32.7 ADDER1.11 | v37.47,20.95 ALU_B.4 | B_BUFF.5 78.42,63.18 78.42,23.18 | AND5.2 78.42,23.18 | AND5.5 78.42,15.56 78.42,23.18
ALU_B4  (via drill 0.35)
  Top 0.152: B_BUFF.6 81.28,60.96 88.42,60.96 89.53,59.85 89.53,49.53 71.6,49.53 70.96,50.16 42.7,50.16 v42.07,49.53 | NAND2.2 24.13,20.32 39.37,20.32 v39.69,20.64
  Bottom 0.152: NAND2.2 21.27,23.18 21.27,32.7 ADDER2.6 | v42.07,49.53 39.53,46.99 39.53,40.01 39.85,39.69 39.85,20.64 | 39.85,20.64 39.85,6.19 39.69,6.03 39.69,2.86 ALU_B.5 | 39.85,20.64 v39.69,20.64
ALU_B5  (via drill 0.35)
  Top 0.152: B_BUFF.7 81.28,58.42 88.42,58.42 89.22,57.63 89.22,49.85 71.75,49.85 71.12,50.48 33.02,50.48 32.07,49.53 v25.4,49.53 | v40.32,5.71 39.69,6.35 v27.3,6.35 | v26.99,13.65 26.67,13.97 NAND2.5
  Bottom 0.152: NAND2.5 24.77,13.97 24.77,42.39 24.45,42.7 | 24.45,42.7 22.86,44.29 ADDER2.2 | v25.4,49.53 24.45,48.58 24.45,42.7 | ALU_B.6 40.32,4.76 v40.32,5.71 | v27.3,6.35 26.99,6.67 v26.99,13.65
ALU_B6  (via drill 0.35)
  Top 0.152: v81.6,50.48 81.28,50.8 v32.38,50.8 | ALU_B.7 43.02,4.6 v31.75,4.6
  Bottom 0.152: ADDER2.15 32.07,42.86 | 32.07,42.86 32.38,42.55 32.38,15.88 NAND2.10 32.07,12.38 32.07,4.92 v31.75,4.6 | B_BUFF.8 81.6,55.56 v81.6,50.48 | v32.38,50.8 32.07,50.48 32.07,42.86
ALU_B7  (via drill 0.35)
  Top 0.152: B_BUFF.9 78.58,53.18 v69.85,53.18 | v69.37,40.64 69.06,40.32 60.17,40.32 57.63,37.78 48.74,37.78 46.83,35.88 43.97,35.88 | 43.97,35.88 32.07,35.88 ADDER2.11 | 43.97,35.88 v43.97,36.2
  Bottom 0.152: NAND2.13 28.89,23.18 28.89,32.7 ADDER2.11 | v69.85,53.18 70.17,52.86 70.17,41.43 v69.37,40.64 | ALU_B.8 47.62,16.67 46.2,18.1 43.97,18.1 v43.97,36.2
ALU_FL_C  (via drill 0.35)
  Top 0.152: v34.13,6.99 82.87,6.99 v85.41,9.53
  Bottom 0.152: AND1.6 32.7,9.84 32.7,8.41 v34.13,6.99 | v85.41,9.53 85.41,35.56 86.68,36.83 FLAG_REG.12
ALU_FL_Z  (via drill 0.35)
  Top 0.152: AND1.3 35.24,18.1 60.96,18.1 61.28,18.41 63.34,18.41 63.66,18.1 69.69,18.1 v71.28,19.68 | v72.71,41.27 73.03,40.96 84.45,40.96 85.41,41.91 FLAG_REG.14
  Bottom 0.152: v71.28,19.68 72.71,21.11 v72.71,41.27
ALU_MUL0  (via drill 0.35)
  Top 0.152: v51.44,41.75 v47.31,37.62
  Bottom 0.152: AND2.3 47.31,20.64 v47.31,37.62 | v51.44,41.75 51.75,42.07 51.75,48.42 54.93,51.59 54.93,70.17 MUL_BUFF.2
ALU_MUL1  (via drill 0.35)
  Top 0.152: v50.8,66.99 52.7,68.9 56.2,68.9 MUL_BUFF.3
  Bottom 0.152: ADDER3.4 36.35,41.43 36.35,61.28 41.12,66.04 50.8,66.04 v50.8,66.99
ALU_MUL2  (via drill 0.35)
  Top 0.152: v49.85,48.9 50.16,49.21 v53.5,49.21
  Bottom 0.152: ADDER4.4 47.31,39.37 47.31,40.96 47.94,41.59 47.94,46.99 v49.85,48.9 | v53.5,49.21 55.24,50.96 55.24,65.41 MUL_BUFF.4
ALU_MUL3
  Bottom 0.152: ADDER5.4 55.56,40.96 55.56,63.18 MUL_BUFF.5
ALU_MUL4
  Bottom 0.152: ADDER5.1 58.74,48.58 58.74,60.64 MUL_BUFF.6
ALU_MUL5  (via drill 0.35)
  Top 0.152: v63.02,59.05 62.39,59.69 MUL_BUFF.7
  Bottom 0.152: ADDER5.13 63.02,41.12 v63.02,59.05
ALU_MUL6  (via drill 0.35)
  Top 0.152: ADDER5.10 64.14,32.38 v60.33,32.38 | v59.69,55.56 58.1,57.15 MUL_BUFF.8
  Bottom 0.152: v60.33,32.38 60.01,32.7 60.01,42.39 59.69,42.7 v59.69,55.56
ALU_MUL7  (via drill 0.35)
  Top 0.152: v60.96,29.21 ADDER5.9 | v60.33,53.66 59.69,54.29 57.47,54.29 MUL_BUFF.9
  Bottom 0.152: v60.96,29.21 60.96,34.61 60.33,35.24 60.33,42.55 60.01,42.86 60.01,53.34 v60.33,53.66
ALU_NAND0  (via drill 0.35)
  Top 0.152: v23.5,71.44 67.63,71.44 NAND_BUFF.2
  Bottom 0.152: NAND1.3 13.65,21.27 13.65,61.59 v23.5,71.44
ALU_NAND1
  Top 0.152: NAND1.6 12.38,10.48 66.99,10.48 67.31,10.16 88.42,10.16 94.14,15.88 94.14,34.45 95.57,34.45 96.36,35.24 96.36,66.36 90.65,66.36 88.11,68.9 69.53,68.9 NAND_BUFF.3
ALU_NAND2  (via drill 0.35)
  Top 0.152: v17.14,46.99 v17.14,38.26
  Bottom 0.152: NAND1.8 20.64,10.48 20.64,19.53 19.53,20.64 17.14,20.64 v17.14,38.26 | v17.14,46.99 17.46,47.31 17.46,64.45 29.21,76.2 70.17,76.2 70.17,68.9 NAND_BUFF.4
ALU_NAND3  (via drill 0.35)
  Top 0.152: NAND1.11 18.1,15.56 10.32,15.56 9.21,16.67 9.21,43.5 12.7,43.5 v18.1,48.9
  Bottom 0.152: v18.1,48.9 20.64,51.44 20.64,67.15 29.37,75.88 66.99,75.88 66.99,66.36 NAND_BUFF.5
ALU_NAND4  (via drill 0.35)
  Top 0.152: NAND2.3 23.18,19.37 v26.67,19.37 | v28.26,62.07 29.37,63.18 50.32,63.18 52.23,61.28 67.63,61.28 NAND_BUFF.6
  Bottom 0.152: v26.67,19.37 28.26,20.95 v28.26,62.07
ALU_NAND5  (via drill 0.35)
  Top 0.152: v27.3,35.72 29.69,38.1 38.58,38.1 41.12,40.64 v46.51,40.64 | v49.53,58.42 66.52,58.42 67.79,59.69 NAND_BUFF.7
  Bottom 0.152: NAND2.6 26.04,11.43 26.04,23.81 27.62,25.4 27.62,35.4 v27.3,35.72 | v46.51,40.64 47.62,41.75 47.62,56.52 v49.53,58.42
ALU_NAND6  (via drill 0.35)
  Top 0.152: NAND2.8 31.43,7.94 38.58,7.94 38.89,8.26 40.48,8.26 40.8,7.94 46.83,7.94 v48.26,9.37 | v47.94,39.21 51.91,43.18 v60.64,43.18 | v62.39,55.24 63.34,56.2 67.63,56.2 NAND_BUFF.8
  Bottom 0.152: v48.26,9.37 47.94,9.68 v47.94,39.21 | v60.64,43.18 62.39,44.93 v62.39,55.24
ALU_NAND7  (via drill 0.35)
  Top 0.152: NAND2.11 31.43,15.56 v35.72,15.56 | v36.51,25.72 36.99,26.19 v71.28,26.19 | v72.39,53.82 71.6,54.61 NAND_BUFF.9
  Bottom 0.152: v35.72,15.56 36.51,16.35 v36.51,25.72 | v71.28,26.19 72.39,27.3 72.39,40.64 72.07,40.96 72.07,48.26 72.39,48.58 v72.39,53.82
ALU_O0  (via drill 0.35)
  Top 0.152: NOR.2 24.13,66.04 v52.07,66.04 | 63.82,70.8 MUL_BUFF.18 | 63.82,70.8 54.29,70.8 SUM_BUFF.18 | 75.25,70.8 NAND_BUFF.18 | 63.82,70.8 75.25,70.8 | 75.25,70.8 81.12,70.8 82.07,69.85 B_BUFF.18 88.27,69.22 96.68,69.22 96.68,15.88 95.73,14.92 94.14,14.92 94.14,13.34 86.84,6.03 77.79,6.03 77.47,5.71 54.61,5.71 ALU_OUT.1
  Bottom 0.152: v52.07,66.04 51.75,66.36 51.75,68.26 SUM_BUFF.18
ALU_O1  (via drill 0.35)
  Top 0.152: NOR.3 22.7,62.39 20.95,62.39 20.64,62.71 20.64,66.36 51.44,66.36 52.39,67.31 SUM_BUFF.17 54.29,68.26 63.82,68.26 | 63.82,68.26 MUL_BUFF.17 | 75.25,68.26 NAND_BUFF.17 | 63.82,68.26 75.25,68.26 | B_BUFF.17 86.68,68.26 v83.82,68.26 75.25,68.26 | ALU_OUT.2 56.83,5.4 77.63,5.4 77.79,5.56 79.38,5.56 v79.53,5.4
  Bottom 0.152: v79.53,5.4 83.82,9.68 v83.82,68.26
ALU_O2  (via drill 0.35)
  Top 0.152: v25.08,64.14 26.67,65.72 51.44,65.72 52.39,64.77 SUM_BUFF.16 54.29,65.72 63.82,65.72 | 63.82,65.72 MUL_BUFF.16 | 75.25,65.72 NAND_BUFF.16 | 63.82,65.72 75.25,65.72 | B_BUFF.16 86.68,65.72 75.25,65.72 | v60.33,6.35 60.64,6.67 v84.77,6.67
  Bottom 0.152: NOR.4 25.08,61.91 v25.08,64.14 | v60.33,6.35 ALU_OUT.3 | v84.77,6.67 84.77,39.37 85.72,40.32 85.72,62.87 B_BUFF.16
ALU_O3  (via drill 0.35)
  Top 0.152: v21.27,63.02 21.75,63.5 52.07,63.5 52.39,63.18 | SUM_BUFF.15 52.39,63.18 | 63.82,63.18 MUL_BUFF.15 | 52.39,63.18 63.82,63.18 | 75.25,63.18 NAND_BUFF.15 | 63.82,63.18 75.25,63.18 | B_BUFF.15 86.68,63.18 v83.19,63.18 75.25,63.18 | ALU_OUT.4 61.44,4.92 v78.11,4.92
  Bottom 0.152: NOR.5 21.27,58.74 v21.27,63.02 | v78.11,4.92 83.19,10 v83.19,63.18
ALU_O4  (via drill 0.35)
  Top 0.152: B_BUFF.14 86.68,60.64 77.15,60.64 NAND_BUFF.14 75.41,60.48 69.85,60.48 69.69,60.64 63.82,60.64 | NOR.9 31.43,53.66 36.04,53.66 38.26,55.88 v48.26,55.88 | 63.82,60.64 MUL_BUFF.14 | 63.82,60.64 54.29,60.64 SUM_BUFF.14
  Bottom 0.152: SUM_BUFF.14 51.75,59.69 50.16,58.1 50.16,57.78 v48.26,55.88 50.48,53.66 50.48,43.34 50.16,43.02 50.16,32.7 51.12,32.7 51.44,33.02 51.44,37.78 54.45,37.78 54.93,37.31 54.93,35.88 57.63,35.88 58.74,34.77 58.74,33.97 59.05,33.66 59.05,19.37 61.44,16.99 61.44,2.7 ALU_OUT.5
ALU_O5  (via drill 0.35)
  Top 0.152: NOR.10 31.43,58.1 48.42,58.1 49.37,57.15 SUM_BUFF.13 54.29,58.1 63.82,58.1 | 63.82,58.1 MUL_BUFF.13 | 75.25,58.1 NAND_BUFF.13 | 63.82,58.1 67.31,58.1 | 67.31,58.1 75.25,58.1 | B_BUFF.13 86.68,58.1 75.25,58.1 | 67.31,58.1 v67.31,58.26
  Bottom 0.152: ALU_OUT.6 63.18,3.49 63.18,34.77 63.66,35.24 66.2,35.24 66.36,35.08 67.31,35.08 67.31,36.04 66.99,36.35 66.99,57.94 v67.31,58.26
ALU_O6  (via drill 0.35)
  Top 0.152: SUM_BUFF.12 54.29,55.56 58.74,55.56 59.69,54.61 MUL_BUFF.12 65.72,55.56 75.25,55.56 | 75.25,55.56 NAND_BUFF.12 | B_BUFF.12 86.68,55.56 75.25,55.56 | NOR.11 31.75,58.42 48.58,58.42 49.21,57.78 v50.8,57.78 | v66.36,27.46 66.99,28.1 v74.93,28.1
  Bottom 0.152: v50.8,57.78 51.75,56.83 51.75,56.2 SUM_BUFF.12 | ALU_OUT.7 66.36,2.86 v66.36,27.46 | v74.93,28.1 74.61,28.42 74.61,53.02 NAND_BUFF.12
ALU_O7  (via drill 0.35)
  Top 0.152: 54.29,51.12 SUM_BUFF.11 | 63.82,51.12 54.29,51.12 | MUL_BUFF.11 63.82,51.12 | 75.25,51.12 NAND_BUFF.11 | 63.82,51.12 71.44,51.12 | 71.44,51.12 75.25,51.12 | v31.43,50.8 32.07,51.44 32.86,51.44 33.18,51.12 54.29,51.12 | 71.44,51.12 v71.44,51.44 | B_BUFF.11 86.68,51.12 75.25,51.12
  Bottom 0.152: FLAG_REG.13 86.04,40.96 86.04,50.48 B_BUFF.11 | NOR.12 32.07,60.64 32.07,51.44 v31.43,50.8 | ALU_OUT.8 70.64,3.97 70.64,33.34 71.12,33.81 71.12,51.12 v71.44,51.44
ALU_OP0  (via drill 0.35)
  Top 0.152: OP_SEL.2 74.14,44.45 75.41,45.72 91.28,45.72 v93.19,47.62
  Bottom 0.152: v93.19,47.62 94.14,48.58 94.14,66.67 95.25,67.79 MICRO1,2.12
ALU_OP1  (via drill 0.35)
  Top 0.152: OP_SEL.3 74.14,41.91 75.41,43.18 v90.17,43.18
  Bottom 0.152: v90.17,43.18 92.55,45.56 92.55,67.63 95.25,70.33 MICRO1,2.14
ALU_SUM0  (via drill 0.35)
  Top 0.152: v13.34,64.77 20.95,72.39 SUM_BUFF.2
  Bottom 0.152: ADDER1.4 9.84,40.96 9.84,44.93 10.95,46.04 13.34,46.04 v13.34,64.77
ALU_SUM1  (via drill 0.35)
  Top 0.152: v12.06,59.53 21.11,68.58 44.45,68.58 SUM_BUFF.3
  Bottom 0.152: ADDER1.1 12.06,47.62 v12.06,59.53
ALU_SUM2  (via drill 0.35)
  Top 0.152: ADDER1.13 20.64,40.96 27.46,40.96 29.69,43.18 v35.08,43.18
  Bottom 0.152: v35.08,43.18 36.04,44.13 36.04,61.44 40.96,66.36 45.72,66.36 SUM_BUFF.4
ALU_SUM3  (via drill 0.35)
  Top 0.152: ADDER1.10 20.32,33.02 v25.72,33.02 | v26.04,64.14 26.35,63.82 44.77,63.82 SUM_BUFF.5
  Bottom 0.152: v25.72,33.02 26.04,33.34 v26.04,64.14
ALU_SUM4  (via drill 0.35)
  Top 0.152: ADDER2.4 23.81,38.42 35.4,38.42 v38.58,41.59
  Bottom 0.152: v38.58,41.59 38.89,41.91 38.89,58.74 41.43,61.28 44.77,61.28 SUM_BUFF.6
ALU_SUM5  (via drill 0.35)
  Top 0.152: ADDER2.1 24.13,45.72 v42.7,45.72
  Bottom 0.152: v42.7,45.72 44.13,47.15 44.13,58.1 SUM_BUFF.7
ALU_SUM6  (via drill 0.35)
  Top 0.152: ADDER2.13 31.91,40.8 v33.02,40.8 | v32.7,55.4 33.5,56.2 44.77,56.2 SUM_BUFF.8
  Bottom 0.152: v33.02,40.8 32.7,41.12 32.7,50.16 33.02,50.48 33.02,51.28 32.7,51.59 v32.7,55.4
ALU_SUM7  (via drill 0.35)
  Top 0.152: ADDER2.10 31.75,33.02 v35.08,33.02 | v36.99,53.66 44.77,53.66 SUM_BUFF.9
  Bottom 0.152: v35.08,33.02 36.99,34.92 v36.99,53.66
CLK  (via drill 0.35)
  Top 0.152: FLAG_REG.7 78.74,30.48 v71.75,30.48 | v71.75,48.9 70.8,49.85 43.34,49.85 42.39,48.9 19.05,48.9 18.41,49.53 CTRL.1
  Bottom 0.152: v71.75,48.9 v71.75,30.48
FL_C  (via drill 0.35)
  Top 0.152: NOT.5 33.66,56.52 31.91,56.52 31.27,55.88 13.97,55.88 v8.26,50.16 | FLAG_REG.5 78.42,38.42 v70.17,38.42 | v70.17,61.12 70.01,60.96 v33.5,60.96
  Bottom 0.152: v8.26,50.16 5.71,47.62 5.71,18.73 2.54,15.56 FLAGS.5 | v70.17,38.42 70.48,38.73 70.48,60.8 v70.17,61.12 | v33.5,60.96 32.7,60.17 32.7,58.74 NOT.5
FL_N  (via drill 0.35)
  Top 0.152: v16.83,60.96 31.27,60.96 31.91,61.59 33.66,61.59 NOT.3 36.99,62.23 v37.62,61.59 | v14.29,47.78 11.91,45.4 9.37,45.4 4.45,40.48 4.45,20.64 2.54,20.64 FLAGS.3 | FLAG_REG.4 80.64,40.01 86.2,40.01 87.15,40.96 88.9,40.96 93.82,45.88 93.82,48.26 v38.26,48.26
  Bottom 0.152: v16.83,60.96 14.29,58.42 v14.29,47.78 | v38.26,48.26 37.62,48.9 v37.62,61.59
FL_Z  (via drill 0.35)
  Top 0.152: 33.34,68.26 NOT.1 | 33.34,68.26 21.75,68.26 v4.45,50.96 | FLAG_REG.3 80.64,42.55 v84.77,42.55 | v84.77,70.48 84.14,71.12 49.05,71.12 46.2,68.26 33.34,68.26
  Bottom 0.152: v4.45,50.96 4.45,27.62 2.54,25.72 FLAGS.1 | v84.77,70.48 v84.77,42.55
GND  (via drill 0.35)
  Top 0.152: POWER.1 C1.2 | 33.34,53.02 23.81,53.02 NOR.7 13.34,52.07 v12.7,52.7 | NOT.7 33.34,53.02 | 44.77,53.02 SUM_BUFF.10 | 33.34,53.02 44.77,53.02 | 56.2,53.02 MUL_BUFF.10 | 44.77,53.02 56.2,53.02 | NAND_BUFF.10 67.63,53.02 56.2,53.02 | 67.63,7.94 58.1,7.94 AND3.7 56.04,10 46.83,10 AND2.7 44.77,9.84 33.34,9.84 | AND4.7 67.63,7.94 | AND5.7 79.06,7.94 67.63,7.94 | NAND1.7 12.38,9.84 21.91,9.84 | NAND2.7 21.91,9.84 | 33.34,9.84 AND1.7 | 21.91,9.84 33.34,9.84 | ADDER1.8 12.38,30.16 21.91,30.16 | ADDER2.8 21.91,30.16 | 21.91,30.16 33.34,30.16 ADDER3.8 35.24,30.16 46.67,30.16 | 58.1,30.16 67.63,30.16 OP_SEL.8 71.44,29.21 72.39,30.16 79.06,30.16 FLAG_REG.8 | ADDER5.8 58.1,30.16 | FLAG_REG.11 87.31,33.97 v82.55,33.97 | 46.67,30.16 ADDER4.8 | 58.1,30.16 46.67,30.16 | OP_SEL.1 69.53,46.04 79.06,46.04 FLAG_REG.1
  Bottom 0.152: NAND_BUFF.10 OP_SEL.1 | C1.2 12.7,69.85 v12.7,52.7 | ADDER3.8 ADDER3.7 32.7,33.34 32.7,35.24 ADDER3.5 | B_BUFF.10 FLAG_REG.1 FLAG_REG.2 82.55,41.91 v82.55,33.97 81.6,33.02 81.6,30.8 FLAG_REG.8 81.92,27.3 81.92,10.32 81.6,10 81.6,8.89 AND5.7 | ADDER4.7 ADDER4.8 | ADDER5.7 ADDER5.8
N$1  (via drill 0.35)
  Top 0.152: ADDER3.11 43.18,35.56 v60.96,35.56 | v62.55,17.14 63.18,16.51 AND3.11
  Bottom 0.152: v60.96,35.56 61.59,34.92 61.59,18.73 62.55,17.78 v62.55,17.14
N$2  (via drill 0.35)
  Top 0.152: AND3.8 63.82,9.84 v60.8,9.84 | v49.85,43.66 49.69,43.5 42.86,43.5 ADDER3.15
  Bottom 0.152: v60.8,9.84 57.63,13.02 50.48,13.02 50.48,26.99 49.53,27.94 49.53,43.34 v49.85,43.66
N$3  (via drill 0.35)
  Top 0.152: v48.58,42.07 47.47,43.18 36.04,43.18 34.77,44.45 ADDER3.2
  Bottom 0.152: AND3.6 54.93,11.43 54.93,10.95 54.45,10.48 48.58,10.48 v48.58,42.07
N$4
  Top 0.152: ADDER1.9 18.1,28.26 10.32,28.26 9.84,28.73 9.84,30.8 21.91,30.8 ADDER2.7
N$5  (via drill 0.35)
  Top 0.152: ADDER3.6 34.92,33.66 40.48,33.66 40.8,33.34 43.02,33.34 44.13,34.45 44.13,35.24 54.45,35.24 v55.24,34.45
  Bottom 0.152: v55.24,34.45 55.56,34.13 55.56,33.81 56.67,32.7 58.74,32.7 58.74,20.64 AND3.3
N$8  (via drill 0.35)
  Top 0.152: AND2.11 52.39,15.56 v44.29,15.56
  Bottom 0.152: v44.29,15.56 43.5,16.35 43.5,35.24 ADDER3.12
N$9  (via drill 0.35)
  Top 0.152: AND2.8 52.07,7.62 v39.21,7.62 | v39.05,39.53 41.43,41.91 ADDER3.14
  Bottom 0.152: v39.21,7.62 39.05,7.78 v39.05,39.53
N$10  (via drill 0.35)
  Top 0.152: v40.48,37.78 41.12,38.42 46.83,38.42 47.31,38.89 47.31,42.86 35.72,42.86 34.77,41.91 ADDER3.3
  Bottom 0.152: AND2.6 43.5,13.65 43.5,14.45 42.39,15.56 40.32,15.56 40.32,37.62 v40.48,37.78
N$11  (via drill 0.35)
  Top 0.152: v55.56,27.62 56.36,26.83 87,26.83 89.22,24.61 89.22,15.56 77.15,15.56 AND4.11
  Bottom 0.152: ADDER4.11 55.56,32.07 v55.56,27.62
N$12  (via drill 0.35)
  Top 0.152: v72.71,45.09 72.39,45.4 56.04,45.4 55.09,44.45 ADDER4.15
  Bottom 0.152: AND4.8 78.42,8.89 78.42,9.37 79.53,10.48 81.6,10.48 81.6,11.91 80.49,13.02 73.98,13.02 73.98,43.81 v72.71,45.09
N$13  (via drill 0.35)
  Top 0.152: AND4.6 67.31,12.7 50.96,12.7 v50.64,12.38 | ADDER4.2 v49.21,44.45
  Bottom 0.152: v50.64,12.38 49.21,13.81 v49.21,44.45
N$14  (via drill 0.35)
  Top 0.152: ADDER4.6 46.04,33.97 51.59,33.97 52.23,33.34 61.59,33.34 61.91,33.66 63.34,33.66 63.98,33.02 v65.56,33.02
  Bottom 0.152: v65.56,33.02 66.99,31.59 66.99,20.64 AND4.3
N$15  (via drill 0.35)
  Top 0.152: ADDER3.1 34.92,46.35 v40.16,46.35
  Bottom 0.152: v40.16,46.35 40.32,46.2 40.32,38.89 41.43,37.78 45.72,37.78 ADDER4.5
N$16
  Bottom 0.152: ADDER3.13 44.45,41.91 ADDER4.3
N$17  (via drill 0.35)
  Top 0.152: ADDER3.10 43.5,33.34 v50.8,33.34
  Bottom 0.152: v50.8,33.34 51.12,33.66 51.12,39.69 ADDER4.14
N$18  (via drill 0.35)
  Top 0.152: ADDER3.9 42.86,28.26 v50.16,28.26
  Bottom 0.152: v50.16,28.26 51.75,29.84 51.75,35.24 ADDER4.12
N$19  (via drill 0.35)
  Top 0.152: v59.37,34.29 ADDER5.6 | v61.59,17.78 78.74,17.78 AND5.3
  Bottom 0.152: v59.37,34.29 59.69,33.97 59.69,19.68 v61.59,17.78
N$20  (via drill 0.35)
  Top 0.152: v73.34,42.55 72.71,43.18 61.59,43.18 60.33,44.45 ADDER5.2
  Bottom 0.152: AND5.6 77.79,11.43 77.79,11.91 76.99,12.7 73.34,12.7 v73.34,42.55
N$21  (via drill 0.35)
  Top 0.152: v89.38,43.81 89.06,43.5 65.72,43.5 ADDER5.15
  Bottom 0.152: AND5.8 89.38,10.64 v89.38,43.81
N$22  (via drill 0.35)
  Top 0.152: ADDER5.11 65.41,33.66 67.15,33.66 67.47,33.34 73.18,33.34 75.09,35.24 v86.04,35.24
  Bottom 0.152: v86.04,35.24 86.04,18.1 AND5.11
N$23  (via drill 0.35)
  Top 0.152: v54.93,45.24 54.13,46.04 46.67,46.04 ADDER4.1
  Bottom 0.152: ADDER5.5 54.93,39.05 v54.93,45.24
N$24
  Top 0.152: ADDER4.13 55.88,41.91 ADDER5.3
N$25  (via drill 0.35)
  Top 0.152: ADDER4.10 54.61,33.02 v62.23,33.02
  Bottom 0.152: v62.23,33.02 62.55,33.34 62.55,36.67 64.29,38.42 66.36,38.42 66.36,40.32 ADDER5.14
N$26  (via drill 0.35)
  Top 0.152: AND1.1 33.66,24.77 31.91,24.77 30.96,25.72 v26.99,25.72
  Bottom 0.152: v26.99,25.72 26.67,26.04 26.67,64.45 23.81,67.31 NOR.1
N$27  (via drill 0.35)
  Top 0.152: AND1.2 33.34,22.54 27.94,22.54 v27.62,22.23
  Bottom 0.152: v27.62,22.23 27.94,22.54 27.94,61.44 27.62,61.75 27.62,62.39 30,64.77 NOR.13
N$28  (via drill 0.35)
  Top 0.152: ADDER4.9 54.29,28.26 v62.23,28.26
  Bottom 0.152: v62.23,28.26 62.87,28.89 62.87,34.92 ADDER5.12
RD_SUM
  Bottom 0.152: AND1.5 36.83,13.97 36.83,25.08 38.42,26.67 38.42,40.48 39.21,41.27 39.21,49.37 NOT.8
RST
  Bottom 0.152: FLAG_REG.15 89.22,46.04 89.22,75.41 88.11,76.52 4.45,76.52 4.45,56.52 CTRL.3
SUB_B
  Top 0.152: ADDER1.7 13.02,33.34 25.08,33.34 25.4,33.66 26.51,33.66 29.37,30.8 71.12,30.8 73.66,33.34 89.69,33.34 94.46,38.1 MICRO3,4.6
SUM_CO  (via drill 0.35)
  Top 0.152: ADDER2.9 v33.02,26.67
  Bottom 0.152: AND1.4 32.7,18.1 32.7,26.35 v33.02,26.67
VCC
  Top 0.152: NAND1.14 20,25.08 29.53,25.08 NAND2.14 31.43,23.18 40.96,23.18 | 40.96,23.18 AND1.14 | 52.39,23.18 AND2.14 | 40.96,23.18 52.39,23.18 | 63.82,23.18 AND3.14 | 52.39,23.18 63.82,23.18 | 63.82,23.18 75.25,23.18 AND4.14 76.68,24.13 77.63,23.18 86.68,23.18 AND5.14 | ADDER1.16 20,47.94 29.53,47.94 ADDER2.16 31.43,47.94 37.62,47.94 38.58,46.99 ADDER3.16 42.86,47.94 52.39,47.94 | ADDER4.16 52.39,47.94 | 63.82,47.94 ADDER5.16 | 52.39,47.94 63.82,47.94 | 75.25,47.94 OP_SEL.16 | 63.82,47.94 75.25,47.94 | FLAG_REG.16 86.68,47.94 75.25,47.94 | B_BUFF.20 B_BUFF.1 NAND_BUFF.20 NAND_BUFF.1 MUL_BUFF.20 MUL_BUFF.1 SUM_BUFF.20 SUM_BUFF.1 C1.1 POWER.2
  Bottom 0.152: NAND1.14 20.64,25.72 20.64,45.4 ADDER1.16 | 41.91,69.85 32.23,69.85 31.91,69.53 31.91,68.74 NOR.14 32.07,65.72 32.07,63.82 30,63.82 28.89,62.71 28.89,48.58 ADDER2.16 | NOT.14 41.91,69.85 | SUM_BUFF.1 41.91,71.12 41.91,69.85